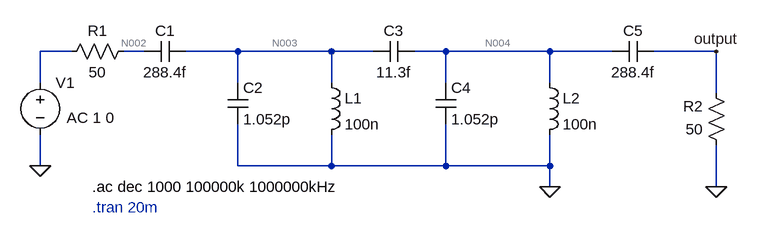
[diagram p0: schematic band_pass_filter.asc]
band_pass_filter.asc, the LTspice schematic file:
Version 4.1
SHEET 1 1080 680
WIRE 32 80 -16 80
WIRE 144 80 112 80
WIRE 288 80 208 80
WIRE 432 80 288 80
WIRE 496 80 432 80
WIRE 608 80 560 80
WIRE 768 80 608 80
WIRE 864 80 768 80
WIRE 1024 80 928 80
WIRE -16 128 -16 80
WIRE 288 128 288 80
WIRE 432 128 432 80
WIRE 608 128 608 80
WIRE 768 128 768 80
WIRE 1024 144 1024 80
WIRE -16 256 -16 208
WIRE 288 256 288 192
WIRE 432 256 432 208
WIRE 432 256 288 256
WIRE 608 256 608 192
WIRE 608 256 432 256
WIRE 768 256 768 208
WIRE 768 256 608 256
WIRE 768 288 768 256
WIRE 1024 288 1024 224
FLAG 1024 80 output
FLAG 1024 288 0
FLAG 768 288 0
FLAG -16 256 0
SYMBOL voltage -16 112 R0
WINDOW 3 41 92 Left 2
WINDOW 123 41 70 Left 2
WINDOW 39 0 0 Left 0
SYMATTR Value ""
SYMATTR Value2 AC 1 0
SYMATTR InstName V1
SYMBOL cap 208 64 R90
WINDOW 0 0 32 VBottom 2
WINDOW 3 32 32 VTop 2
SYMATTR InstName C1
SYMATTR Value 288.4f
SYMBOL cap 272 128 R0
SYMATTR InstName C2
SYMATTR Value 1.052p
SYMBOL ind 416 112 R0
SYMATTR InstName L1
SYMATTR Value 100n
SYMBOL cap 560 64 R90
WINDOW 0 0 32 VBottom 2
WINDOW 3 32 32 VTop 2
SYMATTR InstName C3
SYMATTR Value 11.3f
SYMBOL cap 592 128 R0
SYMATTR InstName C4
SYMATTR Value 1.052p
SYMBOL ind 752 112 R0
SYMATTR InstName L2
SYMATTR Value 100n
SYMBOL cap 928 64 R90
WINDOW 0 0 32 VBottom 2
WINDOW 3 32 32 VTop 2
SYMATTR InstName C5
SYMATTR Value 288.4f
SYMBOL res 128 64 R90
WINDOW 0 0 56 VBottom 2
WINDOW 3 32 56 VTop 2
SYMATTR InstName R1
SYMATTR Value 50
SYMBOL res 1040 240 R180
WINDOW 0 36 76 Left 2
WINDOW 3 36 40 Left 2
SYMATTR InstName R2
SYMATTR Value 50
TEXT 64 288 Left 2 !.ac dec 1000 100000k 1000000kHz
TEXT 64 320 Left 2 ;.tran 20m

The netlist it stands for:
* band_pass_filter.asc
V1 N001 0 AC 1 0
C1 N003 N002 288.4f
C2 N003 0 1.052p
L1 N003 0 100n
C3 N004 N003 11.3f
C4 N004 0 1.052p
L2 N004 0 100n
C5 output N004 288.4f
R1 N002 N001 50
R2 0 output 50
.ac dec 1000 100000k 1000000kHz
* .tran 20m
.backanno
.end

* Results of the author's LTspice run, read from the files saved beside the schematic
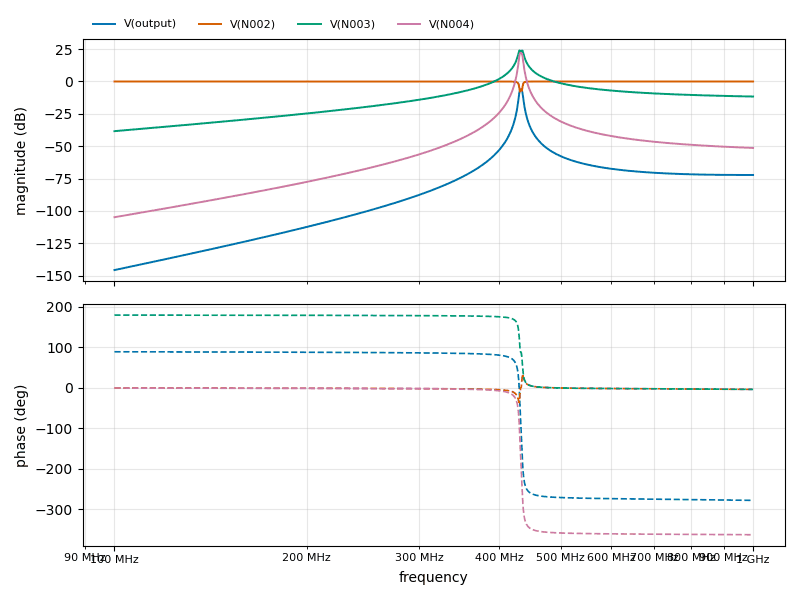
[diagram p1: AC Analysis of band_pass_filter.asc, plotted from the saved traces]
* AC Analysis, 1 run:
*   V(output): -145.79 dB at 100 MHz, -72.26 dB at 1 GHz, peak -6.03 dB at 432.5 MHz, 3 dB below the peak at 430.4 MHz and 435.5 MHz
*   V(N002): -0.00 dB at 100 MHz, -0.02 dB at 1 GHz, peak -0.00 dB at 488.7 MHz, 3 dB below the peak at 436 MHz
*   V(N003): -38.40 dB at 100 MHz, -11.63 dB at 1 GHz, peak 24.01 dB at 430.5 MHz, 3 dB below the peak at 428.8 MHz and 437.2 MHz
*   V(N004): -104.93 dB at 100 MHz, -51.37 dB at 1 GHz, peak 22.12 dB at 432.5 MHz, 3 dB below the peak at 430.4 MHz and 435.5 MHz